# Altium schematic sheet Wireless.SchDoc
size A
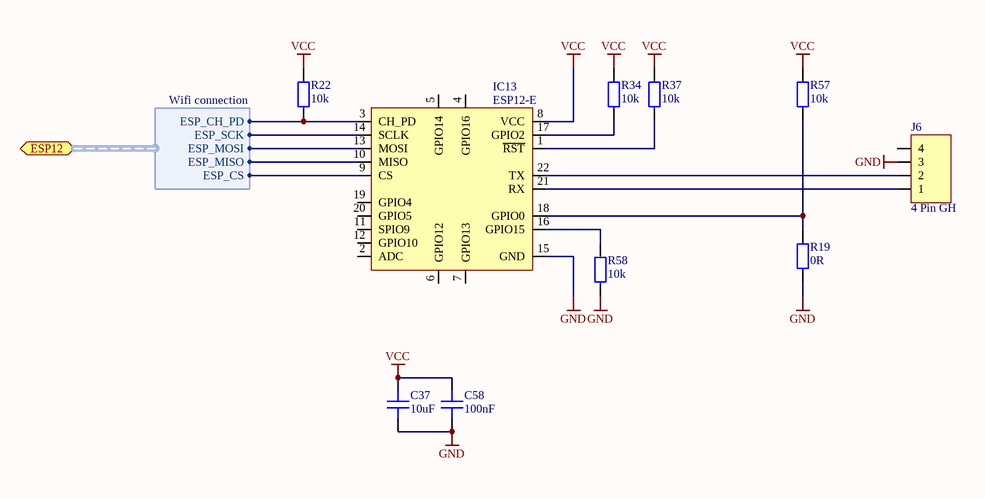
[diagram p0: Wireless.SchDoc]

## Parts
C37  10uF  [CAP 0603]
C58  100nF  [CAP 0603]
IC13  ESP12-E  [ESP8266 ESP-12-E]
J6  4 Pin GH  [BM04B]
R19  0R  [RES 0603]
R22  10k  [RES 0603]
R34  10k  [RES 0603]
R37  10k  [RES 0603]
R57  10k  [RES 0603]
R58  10k  [RES 0603]

## Ports
ESP12 (harness Wifi connection)

## Harnesses
Wifi connection: ESP_CH_PD, ESP_CS, ESP_SCK, ESP_MISO, ESP_MOSI

## Nets
GND: C37.1 C58.1 IC13.15(GND) J6.3 R19.1 R58.1
VCC: C37.2 C58.2 IC13.8(VCC) R22.2 R34.2 R37.2 R57.2
NetIC13_1: IC13.1(~{RST}) R37.1
NetIC13_3: IC13.3(CH_PD) R22.1 ; port ESP12.ESP_CH_PD
NetIC13_9: IC13.9(CS) ; port ESP12.ESP_CS
NetIC13_10: IC13.10(MISO) ; port ESP12.ESP_MISO
NetIC13_13: IC13.13(MOSI) ; port ESP12.ESP_MOSI
NetIC13_14: IC13.14(SCLK) ; port ESP12.ESP_SCK
NetIC13_16: IC13.16(GPIO15) R58.2
NetIC13_17: IC13.17(GPIO2) R34.1
NetIC13_18: IC13.18(GPIO0) R19.2 R57.1
NetIC13_21: IC13.21(RX) J6.1
NetIC13_22: IC13.22(TX) J6.2

Not connected (* = marked no-connect by the designer): IC13 2(ADC) 4(GPIO16) 5(GPIO14) 6(GPIO12) 7(GPIO13) 11(SPIO9) 12(GPIO10) 19(GPIO4) 20(GPIO5); J6 4

## Library data of the parts
C37 C58 = Capacitor: SMT Capacitor
  C37: Value: 10uF
  C58: Value: 100nF
IC13 = ESP-12E: Wifi module, esp12-e, based on ESP8266 chip
J6 = 4 Pin GH: Złącze GH, męskie, proste, 4 piny, SMD
R19 R22 R34 R37 R57 R58 = Resistor: SMDResistor
  R19: Value: 0R
  R22 R34 R37 R57 R58: Value: 10k